# Altium schematic sheet BalEv_FPTG_IO_v1_0.SchDoc
size A4; CompanyName: HESSO; Address1: Route du Rawyl 47; Address2: 1950 Sion; Address3: Switzerland; DocumentNumber: 5; SheetNumber: 8; SheetTotal: 8; PageSetup: Record=PageOptions|CenterHorizontal=True|CenterVertical=True|PrintScale=1.00|XCorrection=1.00|YCorrection=1.00|PrintKind=1|BorderSize=5000000|LeftOffset=0|BottomOffset=0|Orientation=2|PaperLength=1000|PaperWidth=1000|Scale=100|PaperSource=15|PrintQuality=1200|MediaType=1|DitherType=10|PrintScaleMode=1|PaperKind=A4|PaperIndex=9; ProjectName: Project Name
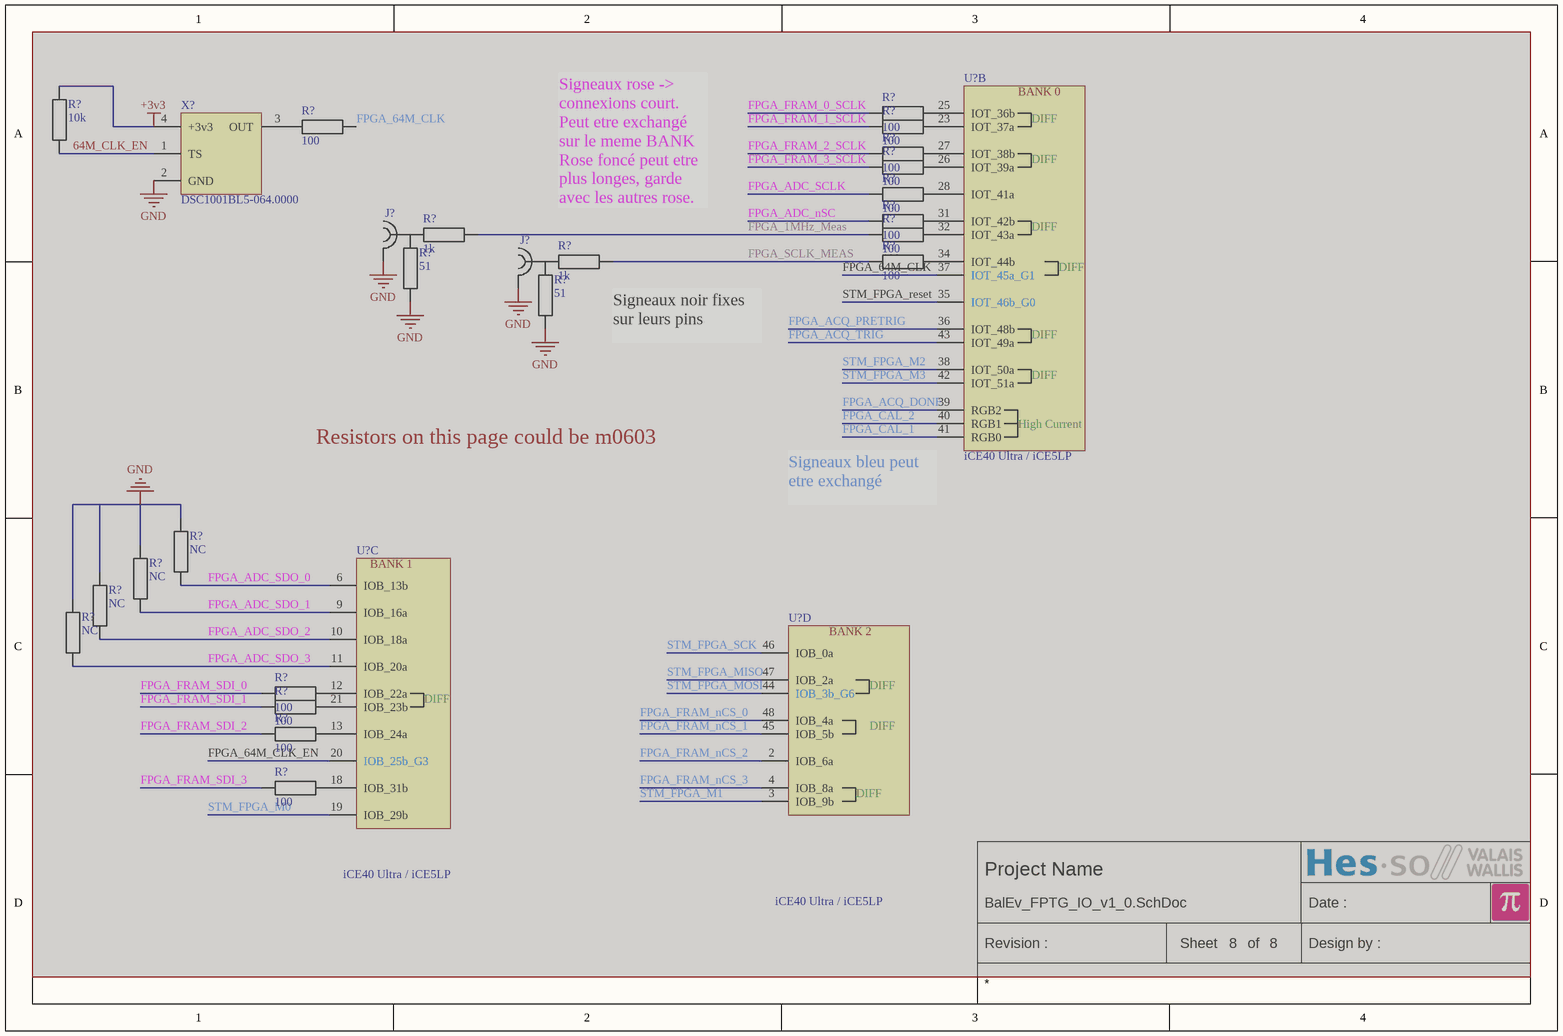
[diagram p0: BalEv_FPTG_IO_v1_0.SchDoc]

## Parts
(Parts that share a designator on the sheet are numbered #1, #2 ... from top to bottom, then left to right.)
J?#1  CONSMA001-SMD-G  [SMA SMD Vertical Linx CONSMA001-SMD-G]  (value not drawn)  (masked out: inside a compile mask, not in the netlist)
J?#2  CONSMA001-SMD-G  [SMA SMD Vertical Linx CONSMA001-SMD-G]  (value not drawn)  (masked out: inside a compile mask, not in the netlist)
R?#1  100  [RESISTOR 1005 REFLOW]  (masked out: inside a compile mask, not in the netlist)
R?#2  100  [RESISTOR 1005 REFLOW]  (masked out: inside a compile mask, not in the netlist)
R?#3  100  [RESISTOR 1005 REFLOW]  (masked out: inside a compile mask, not in the netlist)
R?#4  10k  [RESISTOR 1005 REFLOW]  (masked out: inside a compile mask, not in the netlist)
R?#5  100  [RESISTOR 1005 REFLOW]  (masked out: inside a compile mask, not in the netlist)
R?#6  100  [RESISTOR 1005 REFLOW]  (masked out: inside a compile mask, not in the netlist)
R?#7  100  [RESISTOR 1005 REFLOW]  (masked out: inside a compile mask, not in the netlist)
R?#8  100  [RESISTOR 1005 REFLOW]  (masked out: inside a compile mask, not in the netlist)
R?#9  51  [RESISTOR 1005 REFLOW]  (masked out: inside a compile mask, not in the netlist)
R?#10  1k  [RESISTOR 1005 REFLOW]  (masked out: inside a compile mask, not in the netlist)
R?#11  100  [RESISTOR 1005 REFLOW]  (masked out: inside a compile mask, not in the netlist)
R?#12  51  [RESISTOR 1005 REFLOW]  (masked out: inside a compile mask, not in the netlist)
R?#13  1k  [RESISTOR 1005 REFLOW]  (masked out: inside a compile mask, not in the netlist)
R?#14  100  [RESISTOR 1005 REFLOW]  (masked out: inside a compile mask, not in the netlist)
R?#15  NC  [RESISTOR 1005 REFLOW]  (masked out: inside a compile mask, not in the netlist)
R?#16  NC  [RESISTOR 1005 REFLOW]  (masked out: inside a compile mask, not in the netlist)
R?#17  NC  [RESISTOR 1005 REFLOW]  (masked out: inside a compile mask, not in the netlist)
R?#18  NC  [RESISTOR 1005 REFLOW]  (masked out: inside a compile mask, not in the netlist)
R?#19  100  [RESISTOR 1005 REFLOW]  (masked out: inside a compile mask, not in the netlist)
R?#20  100  [RESISTOR 1005 REFLOW]  (masked out: inside a compile mask, not in the netlist)
R?#21  100  [RESISTOR 1005 REFLOW]  (masked out: inside a compile mask, not in the netlist)
R?#22  100  [RESISTOR 1005 REFLOW]  (masked out: inside a compile mask, not in the netlist)
U?#1  iCE40 Ultra / iCE5LP  [QFN50P700X700X100_HS-49N]  (part B of 4)  (masked out: inside a compile mask, not in the netlist)
U?#2  iCE40 Ultra / iCE5LP  [QFN50P700X700X100_HS-49N]  (part C of 4)  (masked out: inside a compile mask, not in the netlist)
U?#3  iCE40 Ultra / iCE5LP  [QFN50P700X700X100_HS-49N]  (part D of 4)  (masked out: inside a compile mask, not in the netlist)
X?  DSC1001BL5-064.0000  [Oscillator C5.0x3.2 Abracon ASFL1]  (masked out: inside a compile mask, not in the netlist)

## Notes on the sheet
- Signeaux rose -> connexions court. Peut etre exchangé sur le meme BANK
  Rose foncé peut etre plus longes, garde avec les autres rose.
- (near R?#13) Signeaux noir fixes sur leurs pins
- Resistors on this page could be m0603
- (near U?#1) Signeaux bleu peut etre exchangé
- Date :
- Revision :
- Sheet
- of
- Design by :
- (in symbol ICE5LP1K-SG48, part B) BANK 0; DIFF; High Current
- (in symbol ICE5LP1K-SG48, part C) BANK 1; DIFF
- (in symbol ICE5LP1K-SG48, part D) BANK 2; DIFF

## Library data of the parts
J?#1 J?#2 = SMA SMD VERTICAL LINX CONSMA001-SMD-G: SMA TH VERTICAL LINX CONSMA001-SMD-G; Value: CONSMA001-SMD-G
R?#1-R?#22 = Resistor
  R?#1-R?#3 R?#5-R?#8 R?#11 R?#14 R?#19-R?#22: Value: 100
  R?#4: Value: 10k
  R?#9 R?#12: Value: 51
  R?#10 R?#13: Value: 1k
  R?#15-R?#18: Value: NC
U?#1-U?#3 = ICE5LP1K-SG48
X? = Oscillator C5.0x3.2 Abracon ASFL1: Value: DSC1001BL5-064.0000